# EAGLE schematic main (EAGLE 6.2)
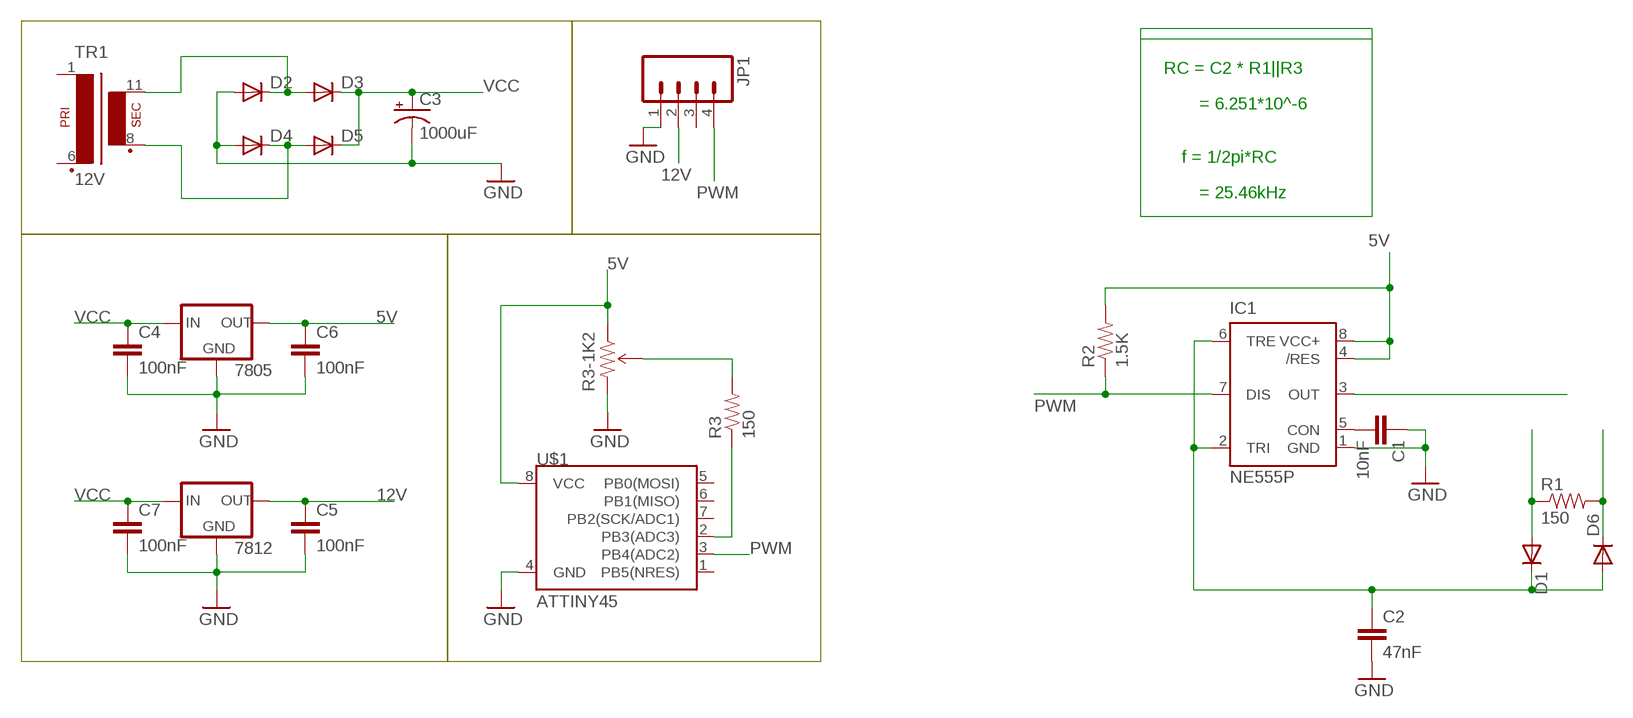
[diagram p0: schematic, sheet 1]

## Parts
7805  V_REG_78XX-TO-220  [TO-220-ALT]
7812  V_REG_78XX-TO-220  [TO-220-ALT]
C1  10nF  CAPPTH1  [CAP-PTH-5MM]
C2  47nF  CAPPTH1  [CAP-PTH-5MM]
C3  1000uF  CAP_POLPTH1  [CPOL-RADIAL-100UF-25V]
C4  100nF  CAPPTH  [CAP-PTH-SMALL]
C5  100nF  CAPPTH  [CAP-PTH-SMALL]
C6  100nF  CAPPTH  [CAP-PTH-SMALL]
C7  100nF  CAPPTH  [CAP-PTH-SMALL]
D1  DIODE1N4148  [DIODE-1N4148]
D2  DIODEPTH  [DIODE-1N4001]
D3  DIODEPTH  [DIODE-1N4001]
D4  DIODEPTH  [DIODE-1N4001]
D5  DIODEPTH  [DIODE-1N4001]
D6  DIODE1N4148  [DIODE-1N4148]
IC1  NE555P  [DIL-08]
JP1  M04POLAR  [MOLEX-1X4]
R1  150  RESISTORPTH-1/4W  [AXIAL-0.4]
R2  1.5K  RESISTORPTH-1/4W  [AXIAL-0.4]
R3  150  RESISTORPTH-1/4W  [AXIAL-0.4]
R3-1K2  TRIMPOTPTH  [TRIM_POT_PTH]
TR1  12V  EI48-1  [EI48-1]
U$1  ATTINY45  [SO08-EIAJ]

## Nets
5V: 7805.OUT C6.1 IC1.4(/RES) IC1.8(VCC+) R2.P$2 R3-1K2.1(CCW) U$1.8(VCC)
12V: 7812.OUT C5.1 JP1.2
GND: 7805.GND 7812.GND C1.1 C2.2 C3.2(-) C4.2 C5.2 C6.2 C7.2 D2.A D4.A IC1.1(GND) JP1.1 R3-1K2.3(CW) U$1.4(GND)
N$2: C1.2 IC1.5(CON)
N$3: R3.P$1 U$1.2(PB3(ADC3))
N$4: D2.C D3.A TR1.11(S4)
N$5: IC1.3(OUT)
N$6: D1.A R1.P$1
N$7: D4.C D5.A TR1.8(S3)
N$8: R3-1K2.2(WIPER) R3.P$2
N$11: D6.C R1.P$2
N$12: C2.1 D1.C D6.A IC1.2(TRI) IC1.6(TRE)
PWM: IC1.7(DIS) JP1.4 R2.P$1 U$1.3(PB4(ADC2))
VCC: 7805.IN 7812.IN C3.1(+) C4.1 C7.1 D3.C D5.C
Unconnected: JP1.3 TR1.1 TR1.6(P2) U$1.1(PB5(NRES)) U$1.5(PB0(MOSI)) U$1.6(PB1(MISO)) U$1.7(PB2(SCK/ADC1))

## Notes on the sheet
- RC = C2 * R1||R3
- = 6.251*10^-6
- f = 1/2pi*RC
- = 25.46kHz

## Library data of the parts
7805 7812 = SparkFun-PowerIC:V_REG_78XX: Voltage Regulator Standard 7805 5V regulator. IGO (Input Ground Output). Spark Fun Electronics SKU : COM-00107
C1 C2 C4-C7 = SparkFun-Passives:CAP: Capacitor Standard 0603 ceramic capacitor, and 0.1" leaded capacitor.
C3 = SparkFun-Passives:CAP_POL: Capacitor Polarized These are standard SMD and PTH capacitors. Normally 10uF, 47uF, and 100uF in electrolytic and tantalum varieties. Always verify the external diameter of the through hole cap, it varies with capacity, voltage, and manufacturer. The EIA devices should be standard.
D1-D6 = SparkFun-DiscreteSemi:DIODE: Diode These are standard reverse protection diodes and small signal diodes. SMA package can handle up to about 1A. SOD-323 can handle about 200mA. What the SOD-323 package when ordering, there are some mfgs out there that are 5-pin packages.
IC1 = SparkFun-AnalogIC:NE555: General purpose bipolar Timer; MF: Arrow Electronics; MPN: NE555N; OC_FARNELL: 1467742; OC_NEWARK: 89K1486
JP1 = SparkFun-Connectors:M04: Header 4 Standard 4-pin 0.1" header. Use with straight break away headers (SKU : PRT-00116), right angle break away headers (PRT-00553), swiss pins (PRT-00743), machine pins (PRT-00117), and female headers (PRT-00115). Molex polarized connector foot print use with SKU : PRT-08231 with associated crimp pins and housings. 1MM SMD Version SKU: PRT-10208
R1-R3 = SparkFun-Passives:RESISTOR: Resistor Basic schematic elements and footprints for 0603, 1206, and PTH resistors.
R3-1K2 = SparkFun-Electromechanical:TRIMPOT: Various small potentiometers for "set-and-forget" applications
TR1 = trafo:EI48-1: TRANSFORMER 1 primary winding, 1 secondary winding ERA
U$1 = SparkFun-DigitalIC:ATTINY45: Atmel 8-pin 2/4/8kB flash uC